# EAGLE schematic robot (EAGLE 7.2.0)
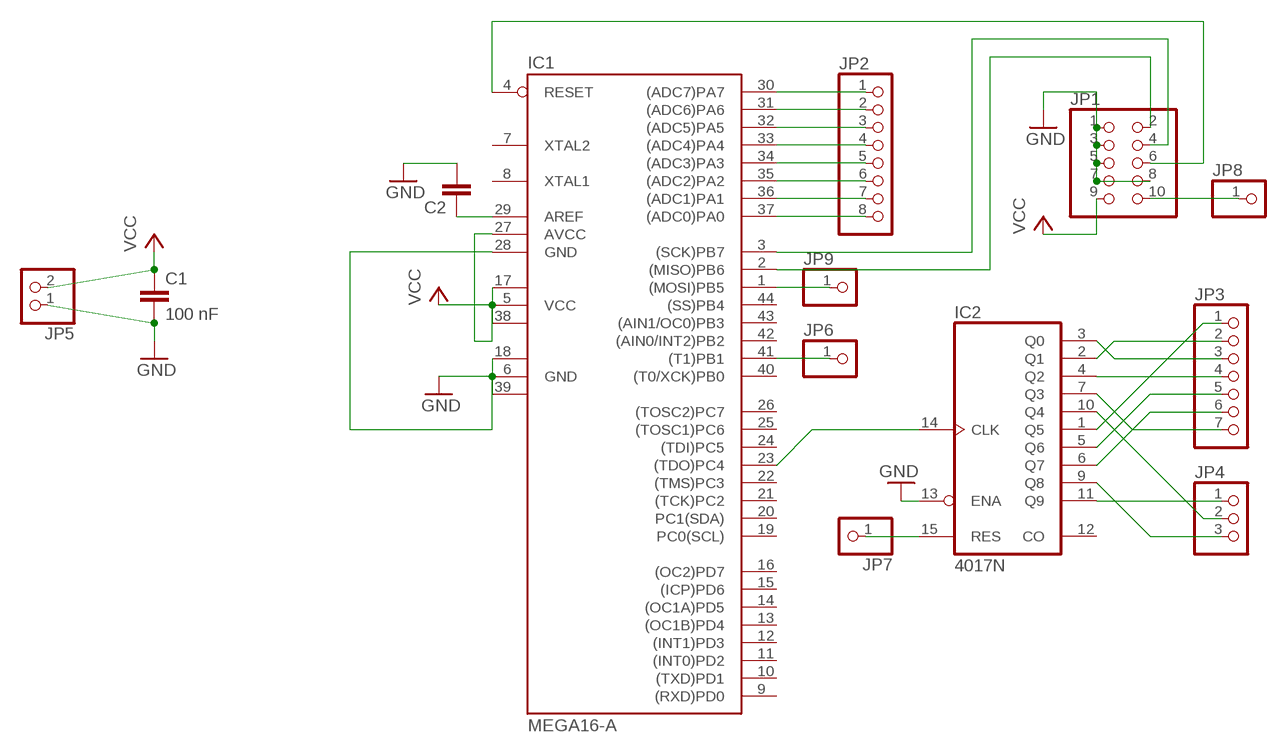
[diagram p0: schematic, sheet 1]

## Parts
C1  100 nF  C5/2.5  [C5B2.5]
C2  C5/2.5  [C5B2.5]
IC1  MEGA16-A  [TQFP44]
IC2  4017N  [DIL16]
JP1  PINHD-2X5  [2X05]
JP2  PINHD-1X8  [1X08]
JP3  PINHD-1X7  [1X07]
JP4  PINHD-1X3  [1X03]
JP5  PINHD-1X2  [1X02]
JP6  PINHD-1X1  [1X01]
JP7  PINHD-1X1  [1X01]
JP8  PINHD-1X1  [1X01]
JP9  PINHD-1X1  [1X01]

## Nets
GND: C1.2 C2.2 IC1.6(GND) IC1.18(GND1) IC1.28(GND) IC1.39(GND2) IC2.13(ENA) JP1.1 JP1.3 JP1.5 JP1.7 JP1.8 JP5.1
N$1: IC1.41((T1)PB1) JP6.1
N$2: IC1.23((TDO)PC4) IC2.14(CLK)
N$3: IC2.1(Q5) JP3.1
N$4: IC2.2(Q1) JP3.2
N$5: IC2.3(Q0) JP3.3
N$6: IC2.4(Q2) JP3.4
N$7: IC2.5(Q6) JP3.5
N$8: IC2.6(Q7) JP3.6
N$9: IC2.7(Q3) JP3.7
N$10: IC2.11(Q9) JP4.1
N$11: IC2.10(Q4) JP4.2
N$12: IC2.9(Q8) JP4.3
N$13: C2.1 IC1.29(AREF)
N$14: IC1.30((ADC7)PA7) JP2.1
N$15: IC1.31((ADC6)PA6) JP2.2
N$16: IC1.32((ADC5)PA5) JP2.3
N$17: IC1.33((ADC4)PA4) JP2.4
N$18: IC1.34((ADC3)PA3) JP2.5
N$19: IC1.35((ADC2)PA2) JP2.6
N$20: IC1.36((ADC1)PA1) JP2.7
N$21: IC1.37((ADC0)PA0) JP2.8
N$22: IC2.15(RES) JP7.1
N$23: IC1.2((MISO)PB6) JP1.2
N$24: IC1.3((SCK)PB7) JP1.4
N$25: JP1.10 JP8.1
N$26: IC1.4(RESET) JP1.6
N$27: IC1.1((MOSI)PB5) JP9.1
VCC: C1.1 IC1.5(VCC) IC1.17(VCC1) IC1.27(AVCC) IC1.38(VCC2) JP1.9 JP5.2
Unconnected: IC1.7(XTAL2) IC1.8(XTAL1) IC1.9((RXD)PD0) IC1.10((TXD)PD1) IC1.11((INT0)PD2) IC1.12((INT1)PD3) IC1.13((OC1B)PD4) IC1.14((OC1A)PD5) IC1.15((ICP)PD6) IC1.16((OC2)PD7) IC1.19(PC0(SCL)) IC1.20(PC1(SDA)) IC1.21((TCK)PC2) IC1.22((TMS)PC3) IC1.24((TDI)PC5) IC1.25((TOSC1)PC6) IC1.26((TOSC2)PC7) IC1.40((T0/XCK)PB0) IC1.42((AIN0/INT2)PB2) IC1.43((AIN1/OC0)PB3) IC1.44((SS)PB4) IC2.12(CO)

## Power pins joined to a net without a drawn wire
VDD: IC2.16(VDD)
VSS: IC2.8(VSS)

## Library data of the parts
C1 C2 = capacitor-wima:C: CAPACITOR naming: grid - package width
IC1 = atmel:MEGA16: MICROCONTROLLER 16 Kbytes FLASH 1 kbytes SRAM 512 bytes EEPROM USART 8-channel 10 bit ADC Source: avr.lbr; MPN: ATMEGA16-16AU; OC_FARNELL: 9171134; OC_NEWARK: 96K6515
IC2 = 40xx:4017: COUNTER/DIVIDER
JP1 = pinhead:PINHD-2X5: PIN HEADER
JP2 = pinhead:PINHD-1X8: PIN HEADER
JP3 = pinhead:PINHD-1X7: PIN HEADER
JP4 = pinhead:PINHD-1X3: PIN HEADER
JP5 = pinhead:PINHD-1X2: PIN HEADER
JP6-JP9 = pinhead:PINHD-1X1: PIN HEADER